# Altium schematic sheet mother.SchDoc
size A
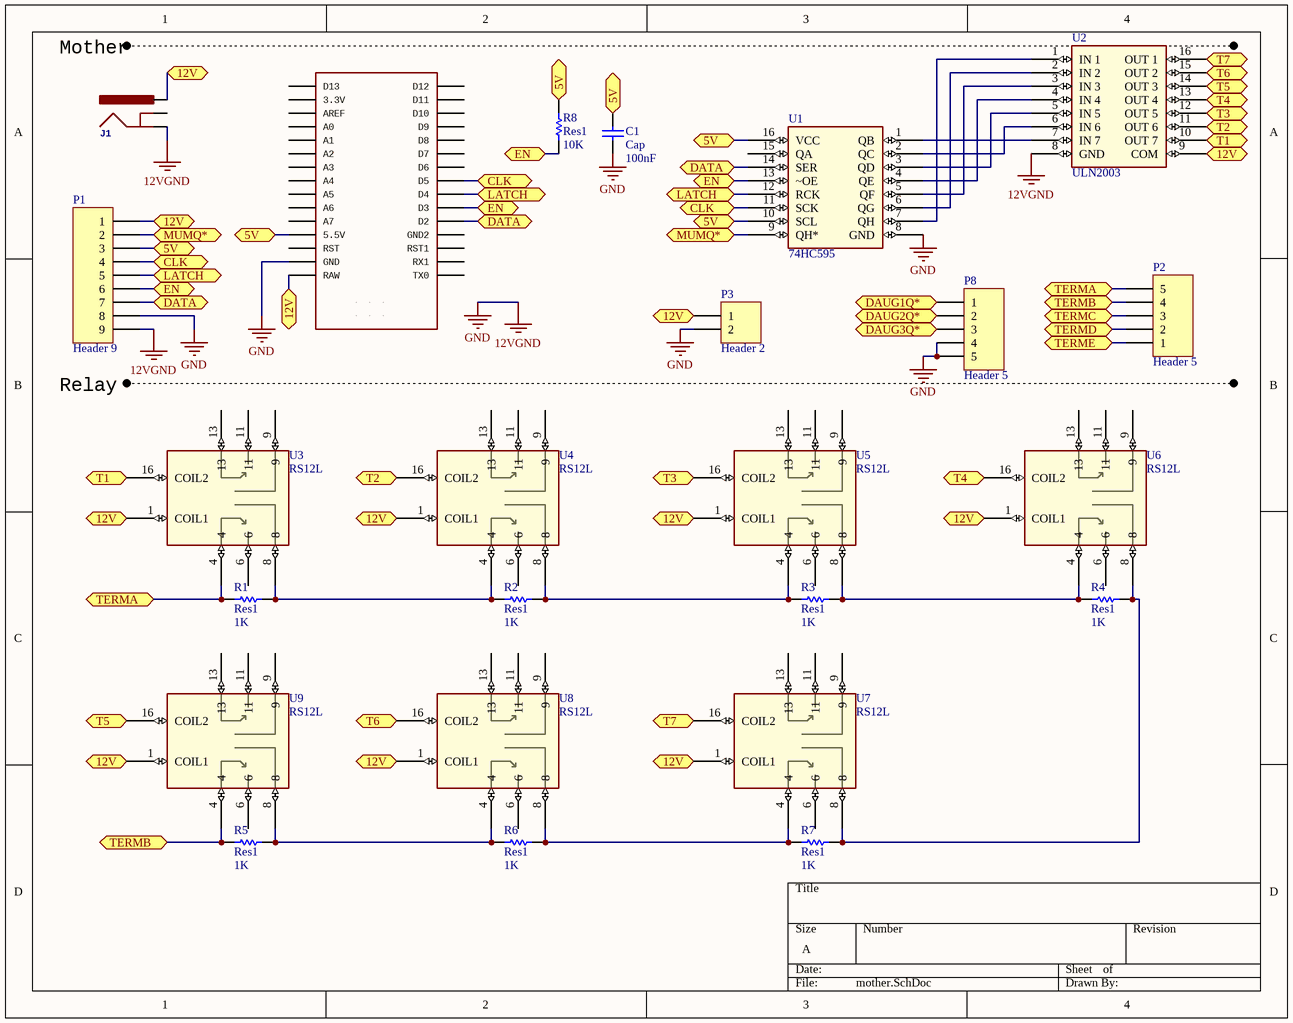
[diagram p0: mother.SchDoc]

## Parts
1  Arduino Nano  [NANO]  (value not drawn)
C1  Cap  value 100nF  [RAD-0.3]
J1  (no value)  [POWER_JACK_PTH]
P1  Header 9  [HDR1X9]
P2  Header 5  [HDR1X5]
P3  Header 2  [HDR1X2]
P8  Header 5  [HDR1X5]
R1  Res1  value 1K  [AXIAL-0.3]
R2  Res1  value 1K  [AXIAL-0.3]
R3  Res1  value 1K  [AXIAL-0.3]
R4  Res1  value 1K  [AXIAL-0.3]
R5  Res1  value 1K  [AXIAL-0.3]
R6  Res1  value 1K  [AXIAL-0.3]
R7  Res1  value 1K  [AXIAL-0.3]
R8  Res1  value 10K  [AXIAL-0.3]
U1  74HC595  [DIP16]
U2  ULN2003  [DIP16]
U3  RS12L  [RS-12]
U4  RS12L  [RS-12]
U5  RS12L  [RS-12]
U6  RS12L  [RS-12]
U7  RS12L  [RS-12]
U8  RS12L  [RS-12]
U9  RS12L  [RS-12]

## Ports
5V (bidir), 12V (bidir), CLK (bidir), DATA (bidir), DAUG1Q* (bidir), DAUG2Q* (bidir), DAUG3Q* (bidir), EN (bidir), LATCH (bidir), MUMQ* (bidir), T1 (bidir), T2 (bidir), T3 (bidir), T4 (bidir), T5 (bidir), T6 (bidir), T7 (bidir), TERMA (bidir), TERMB (bidir), TERMC (bidir), TERMD (bidir), TERME (bidir)

## Nets
12VGND: 1.GND C1.1 J1.GND P1.8 P1.9 P3.2 P8.4 P8.5 U1.8(GND) U2.8(GND)  [also labelled GND]
5V: 1.5V(5.5V) C1.2 P1.3 R8.2 U1.10(SCL) U1.16(VCC) ; port 5V
12V: 1.RAW J1.PWR P1.1 P3.1 U2.9(COM) U3.1(COIL1) U4.1(COIL1) U5.1(COIL1) U6.1(COIL1) U7.1(COIL1) U8.1(COIL1) U9.1(COIL1) ; port 12V
CLK: 1.D5 P1.4 U1.11(SCK) ; port CLK
DATA: 1.D2 P1.7 U1.14(SER) ; port DATA
DAUG1Q*: P8.1 ; port DAUG1Q*
DAUG2Q*: P8.2 ; port DAUG2Q*
DAUG3Q*: P8.3 ; port DAUG3Q*
EN: 1.D3 P1.6 R8.1 U1.13(~OE) ; port EN
LATCH: 1.D4 P1.5 U1.12(RCK) ; port LATCH
MUMQ*: P1.2 U1.9(QH*) ; port MUMQ*
T1: U2.10(OUT_7) U3.16(COIL2) ; port T1
T2: U2.11(OUT_6) U4.16(COIL2) ; port T2
T3: U2.12(OUT_5) U5.16(COIL2) ; port T3
T4: U2.13(OUT_4) U6.16(COIL2) ; port T4
T5: U2.14(OUT_3) U9.16(COIL2) ; port T5
T6: U2.15(OUT_2) U8.16(COIL2) ; port T6
T7: U2.16(OUT_1) U7.16(COIL2) ; port T7
TERMA: P2.5 R1.1 U3.4 ; port TERMA
TERMB: P2.4 R5.1 U9.4 ; port TERMB
TERMC: P2.3 ; port TERMC
TERMD: P2.2 ; port TERMD
TERME: P2.1 ; port TERME
NetR1_2: R1.2 R2.1 U3.8 U4.4
NetR2_2: R2.2 R3.1 U4.8 U5.4
NetR3_2: R3.2 R4.1 U5.8 U6.4
NetR4_2: R4.2 R7.2 U6.8 U7.8
NetR5_2: R5.2 R6.1 U8.4 U9.8
NetR6_2: R6.2 R7.1 U7.4 U8.8
NetU1_1: U1.1(QB) U2.7(IN_7)
NetU1_2: U1.2(QC) U2.6(IN_6)
NetU1_3: U1.3(QD) U2.5(IN_5)
NetU1_4: U1.4(QE) U2.4(IN_4)
NetU1_5: U1.5(QF) U2.3(IN_3)
NetU1_6: U1.6(QG) U2.2(IN_2)
NetU1_7: U1.7(QH) U2.1(IN_1)

Not connected (* = marked no-connect by the designer): 1 3.3V A0 A1 A2 A3 A4 A5 A6 A7 AREF D6 D7 D8 D9 D10 D11 D12 D13 GND1(GND2) ICSP1 ICSP2 ICSP3 ICSP4 ICSP5 ICSP6 RST RST1 RX1 TX0; J1 GNDBREAK; U1 15(QA); U3 6 9 11 13; U4 6 9 11 13; U5 6 9 11 13; U6 6 9 11 13; U7 6 9 11 13; U8 6 9 11 13; U9 6 9 11 13

## Notes on the sheet
- Mother
- (near P1) Relay

## Library data of the parts
1 = NANO: GateName_1: G$1; SymbolName_1: NANO; LibraryName: Arduino-clone; DeviceSetName: NANO; Package: NANO
C1 = Cap: Capacitor; Published: 8-Jun-2000; LatestRevisionDate: 17-Jul-2002; LatestRevisionNote: Re-released for DXP Platform.; PackageReference: RAD-0.3; Publisher: Altium Limited; PackageDescription: Radial Cap, Thru-Hole; 2 Leads; 0.3 in Pin Spacing
J1 = POWER_JACK: GateName_1: G$1; SymbolName_1: POWERJACK; PROD_ID: CONN-08197; LibraryName: SparkFun-Connectors; DeviceSetName: POWER_JACK; Package: POWER_JACK_PTH
P1 = Header 9: Header, 9-Pin; LatestRevisionDate: 17-Jul-2002; LatestRevisionNote: Re-released for DXP Platform.; Publisher: Altium Limited
P2 P8 = Header 5: Header, 5-Pin; LatestRevisionDate: 17-Jul-2002; LatestRevisionNote: Re-released for DXP Platform.; Publisher: Altium Limited
P3 = Header 2: Header, 2-Pin; LatestRevisionDate: 17-Jul-2002; LatestRevisionNote: Re-released for DXP Platform.; Publisher: Altium Limited
R1-R8 = Res1: Resistor; Published: 8-Jun-2000; LatestRevisionDate: 17-Jul-2002; LatestRevisionNote: Re-released for DXP Platform.; PackageReference: AXIAL-0.3; Publisher: Altium Limited; PackageDescription: Axial Device, Thru-Hole; 2 Leads; 0.3 in Pin Spacing